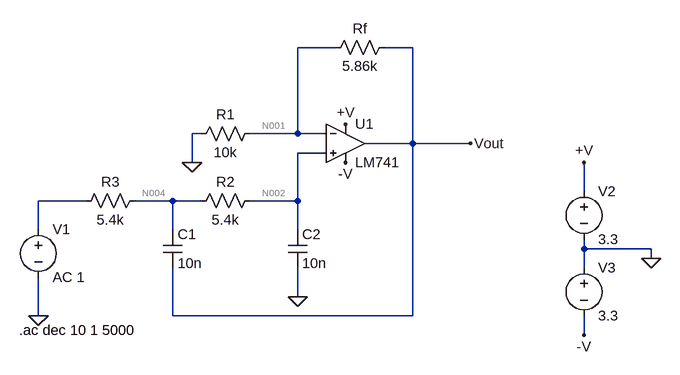
[diagram p0: schematic butterworth filter.asc]
butterworth filter.asc, the LTspice schematic file:
Version 4
SHEET 1 2948 680
WIRE 176 -16 112 -16
WIRE 304 -16 256 -16
WIRE -48 128 -64 128
WIRE 112 128 112 -16
WIRE 112 128 32 128
WIRE 160 128 112 128
WIRE 304 144 304 -16
WIRE 304 144 224 144
WIRE 400 144 304 144
WIRE 160 160 112 160
WIRE -64 176 -64 128
WIRE 2816 224 2816 176
WIRE -240 240 -320 240
WIRE -96 240 -160 240
WIRE -48 240 -96 240
WIRE 112 240 112 160
WIRE 112 240 32 240
WIRE -320 288 -320 240
WIRE -96 288 -96 240
WIRE 112 288 112 240
WIRE 2816 320 2816 304
WIRE 2928 320 2816 320
WIRE 2928 336 2928 320
WIRE 2816 352 2816 320
WIRE 112 400 112 352
WIRE -320 432 -320 368
WIRE -96 432 -96 352
WIRE 304 432 304 144
WIRE 304 432 -96 432
WIRE 2816 464 2816 432
FLAG -320 432 0
FLAG 112 400 0
FLAG -64 176 0
FLAG 2928 336 0
FLAG 192 112 +V
FLAG 192 176 -V
FLAG 2816 176 +V
FLAG 2816 464 -V
FLAG 400 144 Vout
SYMBOL res 48 112 R90
WINDOW 0 0 56 VBottom 2
WINDOW 3 32 56 VTop 2
SYMATTR InstName R1
SYMATTR Value 10k
SYMBOL res 48 224 R90
WINDOW 0 0 56 VBottom 2
WINDOW 3 32 56 VTop 2
SYMATTR InstName R2
SYMATTR Value 5.4k
SYMBOL res -144 224 R90
WINDOW 0 0 56 VBottom 2
WINDOW 3 32 56 VTop 2
SYMATTR InstName R3
SYMATTR Value 5.4k
SYMBOL res 272 -32 R90
WINDOW 0 0 56 VBottom 2
WINDOW 3 32 56 VTop 2
SYMATTR InstName Rf
SYMATTR Value 5.86k
SYMBOL cap -112 288 R0
SYMATTR InstName C1
SYMATTR Value 10n
SYMBOL cap 96 288 R0
SYMATTR InstName C2
SYMATTR Value 10n
SYMBOL voltage -320 272 R0
WINDOW 123 0 0 Left 0
WINDOW 39 0 0 Left 0
SYMATTR InstName V1
SYMATTR Value AC 1
SYMBOL voltage 2816 208 R0
WINDOW 123 0 0 Left 0
WINDOW 39 0 0 Left 0
SYMATTR InstName V2
SYMATTR Value 3.3
SYMBOL voltage 2816 336 R0
WINDOW 123 0 0 Left 0
WINDOW 39 0 0 Left 0
SYMATTR InstName V3
SYMATTR Value 3.3
SYMBOL OpAmps\\LM741 192 80 R0
SYMATTR InstName U1
TEXT -352 456 Left 2 !.ac dec 10 1 5000

The netlist it stands for:
* butterworth filter.asc
R1 N001 0 10k
R2 N002 N004 5.4k
R3 N004 N003 5.4k
Rf Vout N001 5.86k
C1 N004 Vout 10n
C2 N002 0 10n
V1 N003 0 AC 1
V2 +V 0 3.3
V3 0 -V 3.3
XU1 N002 N001 +V -V Vout LM741  ; pins In+ In- V+ V- OUT
.ac dec 10 1 5000
.lib LM741.lib
.backanno
.end

* Results of the author's LTspice run, read from the files saved beside the schematic
* Operating Point, zero values left out:
*   V(n001) = 375 µV
*   V(n002) = -625 µV
*   V(n004) = -312.5 µV
*   V(vout) = 1.192 mV
*   V(+v) = 3.3 V
*   V(-v) = -3.3 V
*   I(Rf) = 139.4 nA
*   I(R3) = -57.87 nA
*   I(R2) = -57.87 nA
*   I(R1) = 37.5 nA
*   I(V3) = -1.409 mA
*   I(V2) = -1.409 mA
*   I(V1) = -57.87 nA
*   Ix(u1:1) = 57.87 nA
*   Ix(u1:2) = 101.9 nA
*   Ix(u1:99) = 1.409 mA
*   Ix(u1:50) = -1.409 mA
*   Ix(u1:28) = -139.4 nA
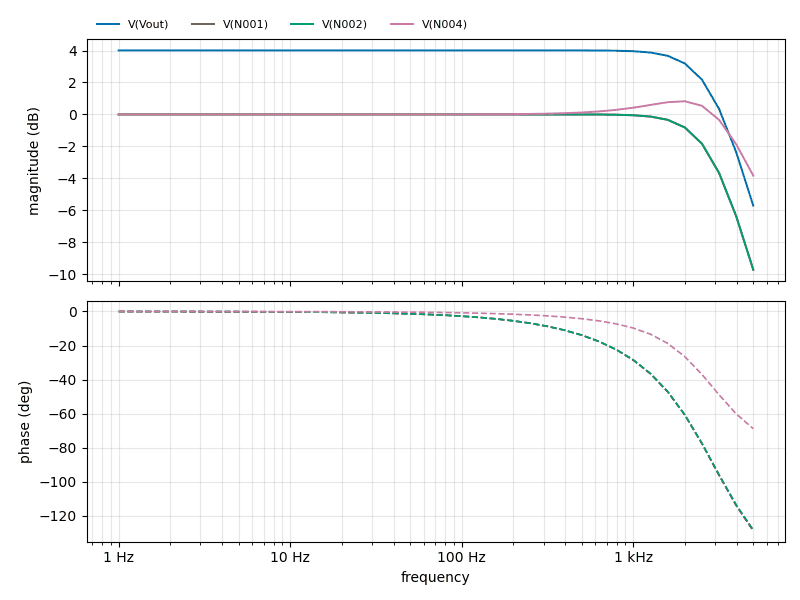
[diagram p1: AC Analysis of butterworth filter.asc, plotted from the saved traces]
* AC Analysis, 1 run:
*   V(Vout): 4.01 dB at 1 Hz, -5.71 dB at 5 kHz, peak 4.01 dB at 251.2 Hz, 3 dB below the peak at 2.912 kHz
*   V(N001): 0.00 dB at 1 Hz, -9.71 dB at 5 kHz, peak 0.00 dB at 251.2 Hz, 3 dB below the peak at 2.912 kHz
*   V(N002): 0.00 dB at 1 Hz, -9.71 dB at 5 kHz, peak 0.00 dB at 251.2 Hz, 3 dB below the peak at 2.912 kHz
*   V(N004): 0.00 dB at 1 Hz, -3.83 dB at 5 kHz, peak 0.82 dB at 1.995 kHz, 3 dB below the peak at 4.128 kHz